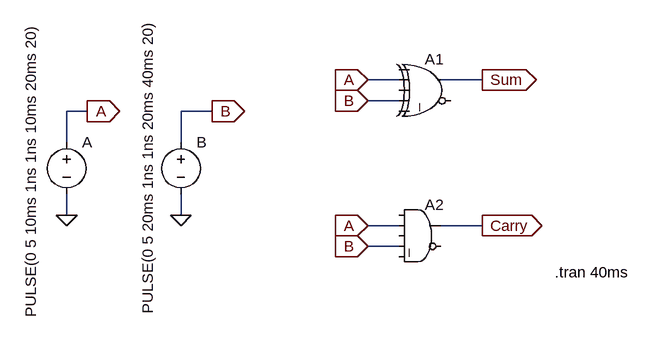
[diagram p0: schematic Half Adder.asc]
Half Adder.asc, the LTspice schematic file:
Version 4
SHEET 1 880 680
WIRE 432 -240 384 -240
WIRE 560 -240 496 -240
WIRE 432 -208 384 -208
WIRE -48 -192 -80 -192
WIRE 144 -192 96 -192
WIRE -80 -144 -80 -192
WIRE 96 -144 96 -192
WIRE -80 -32 -80 -64
WIRE 96 -32 96 -64
WIRE 432 -16 384 -16
WIRE 560 -16 496 -16
WIRE 432 16 384 16
FLAG -80 -32 0
FLAG 96 -32 0
FLAG -48 -192 A
IOPIN -48 -192 Out
FLAG 144 -192 B
IOPIN 144 -192 Out
FLAG 384 -240 A
IOPIN 384 -240 In
FLAG 384 -16 A
IOPIN 384 -16 In
FLAG 384 -208 B
IOPIN 384 -208 In
FLAG 384 16 B
IOPIN 384 16 In
FLAG 560 -240 Sum
IOPIN 560 -240 Out
FLAG 560 -16 Carry
IOPIN 560 -16 Out
SYMBOL voltage -80 -160 R0
WINDOW 3 -55 -166 VRight 2
WINDOW 123 0 0 Left 0
WINDOW 39 0 0 Left 0
SYMATTR InstName A
SYMATTR Value PULSE(0 5 10ms 1ns 1ns 10ms 20ms 20)
SYMBOL voltage 96 -160 R0
WINDOW 3 -51 -171 VRight 2
WINDOW 123 0 0 Left 0
WINDOW 39 0 0 Left 0
SYMATTR InstName B
SYMATTR Value PULSE(0 5 20ms 1ns 1ns 20ms 40ms 20)
SYMBOL Digital\\xor 480 -288 R0
SYMATTR InstName A1
SYMBOL Digital\\and 464 -64 R0
SYMATTR InstName A2
TEXT 672 56 Left 2 !.tran 40ms

The netlist it stands for:
* Half Adder.asc
V§A A 0 PULSE(0 5 10ms 1ns 1ns 10ms 20ms 20)
V§B B 0 PULSE(0 5 20ms 1ns 1ns 20ms 40ms 20)
A1 0 A 0 B 0 0 Sum 0 XOR
A2 0 A 0 B 0 0 Carry 0 AND
.tran 40ms
.backanno
.end